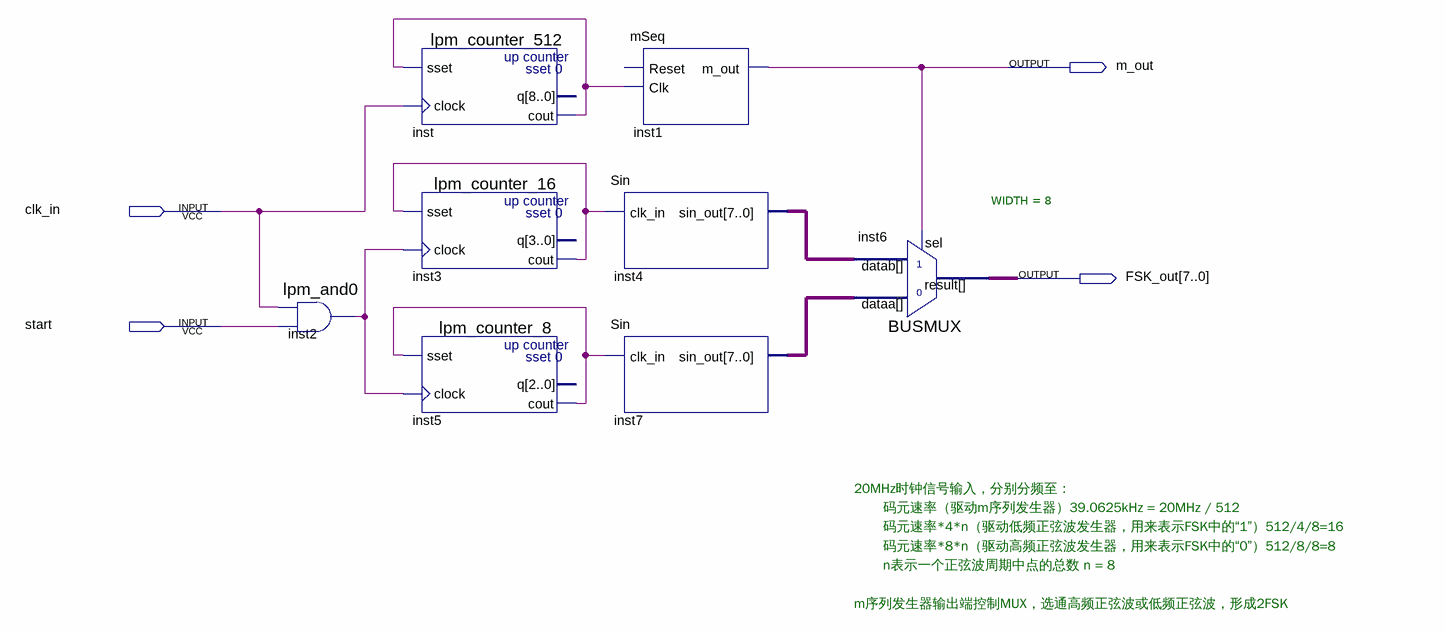
[diagram p0: schematic sheet]
// Quartus schematic 2FSK.bdf as structural Verilog: 8 symbols, 4 pins
module \2FSK  (
  input  clk_in,
  input  start,
  output m_out,
  output [7:0] FSK_out
);

  wire inst2_result, inst3_cout, inst5_cout, inst_cout;
  wire [7:0] inst4_sin_out, inst7_sin_out;

  lpm_and0 inst2 (.data0(clk_in), .data1(start), .result(inst2_result));
  lpm_counter_512 inst (.sset(inst_cout), .clock(clk_in), .cout(inst_cout));  // open: q
  lpm_counter_16 inst3 (.sset(inst3_cout), .clock(inst2_result), .cout(inst3_cout));  // open: q
  lpm_counter_8 inst5 (.sset(inst5_cout), .clock(inst2_result), .cout(inst5_cout));  // open: q
  mSeq inst1 (.Clk(inst_cout), .m_out(m_out));  // open: Reset
  Sin inst4 (.clk_in(inst3_cout), .sin_out(inst4_sin_out));
  Sin inst7 (.clk_in(inst5_cout), .sin_out(inst7_sin_out));
  BUSMUX #(.WIDTH(8)) inst6 (.datab(inst4_sin_out), .sel(m_out), .dataa(inst7_sin_out), .result(FSK_out));

  // Notes on the sheet:
  //   20MHz时钟信号输入，分别分频至：
  //   码元速率（驱动m序列发生器）39.0625kHz = 20MHz / 512
  //   码元速率*4*n（驱动低频正弦波发生器，用来表示FSK中的“1”）512/4/8=16
  //   码元速率*8*n（驱动高频正弦波发生器，用来表示FSK中的“0”）512/8/8=8
  //   n表示一个正弦波周期中点的总数 n = 8
  //   m序列发生器输出端控制MUX，选通高频正弦波或低频正弦波，形成2FSK
endmodule
